# Altium project STM32F303VCT6_PLC.PrjPcb (part 1 of 2)
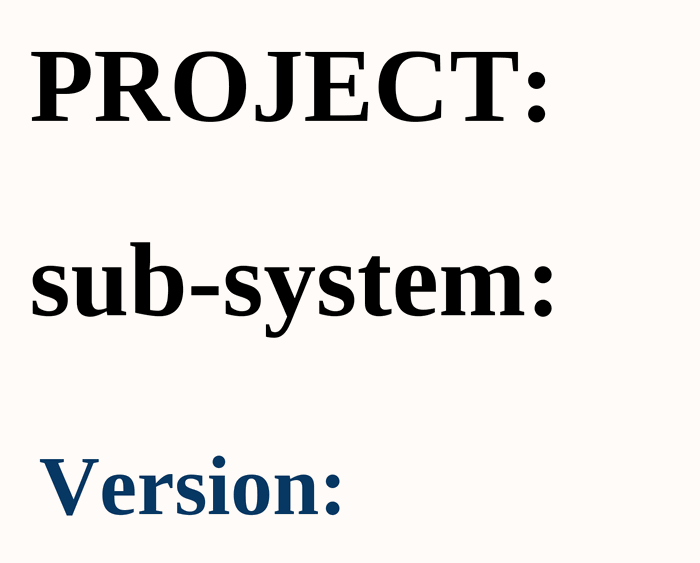
[diagram p0: 01_COVER PAGE.SchDoc]
MasterProject: STM32 PLC
12 sheets, 269 parts. Net scope: flat (ports and power ports of the same name join across sheets).
Board file: STM32F303VCT6_PLC.PcbDoc
Sheets:
  01_COVER PAGE.SchDoc
  02_BLOCK DIAGRAM.SchDoc
  03_INDEX.SchDoc
  04_STM32F303VCT6.SchDoc
  05_INPUT.SchDoc
  06_DIGITAL.SchDoc
  07_DADC.SchDoc
  08_INPUTCAPTURE_ENCODER.SchDoc
  09_CAN.SchDoc
  10_ADC.SchDoc
  11_DAC.SchDoc
  12_LED.SchDoc

## Sheet 01_COVER PAGE.SchDoc
size 420 x 297 mm; SheetNumber: 1; SheetTotal: 12

### Notes on the sheet
- PROJECT:
- sub-system:
- Version:
- Sub-system:
- Project:
- Design by:
- Sheet title:
- Sheet
- of
- Checked by:
- Approved by:
- Doc No:
- Revision:
- Size:
- Date:
- A3

## Sheet 02_BLOCK DIAGRAM.SchDoc
size 420 x 297 mm; SheetNumber: 2; SheetTotal: 12

### Notes on the sheet
- Sub-system:
- Project:
- Design by:
- Sheet title:
- Sheet
- of
- Checked by:
- Approved by:
- Doc No:
- Revision:
- Size:
- Date:
- A3

## Sheet 03_INDEX.SchDoc
size 420 x 297 mm; SheetNumber: 3; SheetTotal: 12

### Notes on the sheet
- Sub-system:
- Project:
- Design by:
- Sheet title:
- Sheet
- of
- Checked by:
- Approved by:
- Doc No:
- Revision:
- Size:
- Date:
- A3

## Sheet 04_STM32F303VCT6.SchDoc
size 420 x 297 mm; SheetNumber: 4; SheetTotal: 12
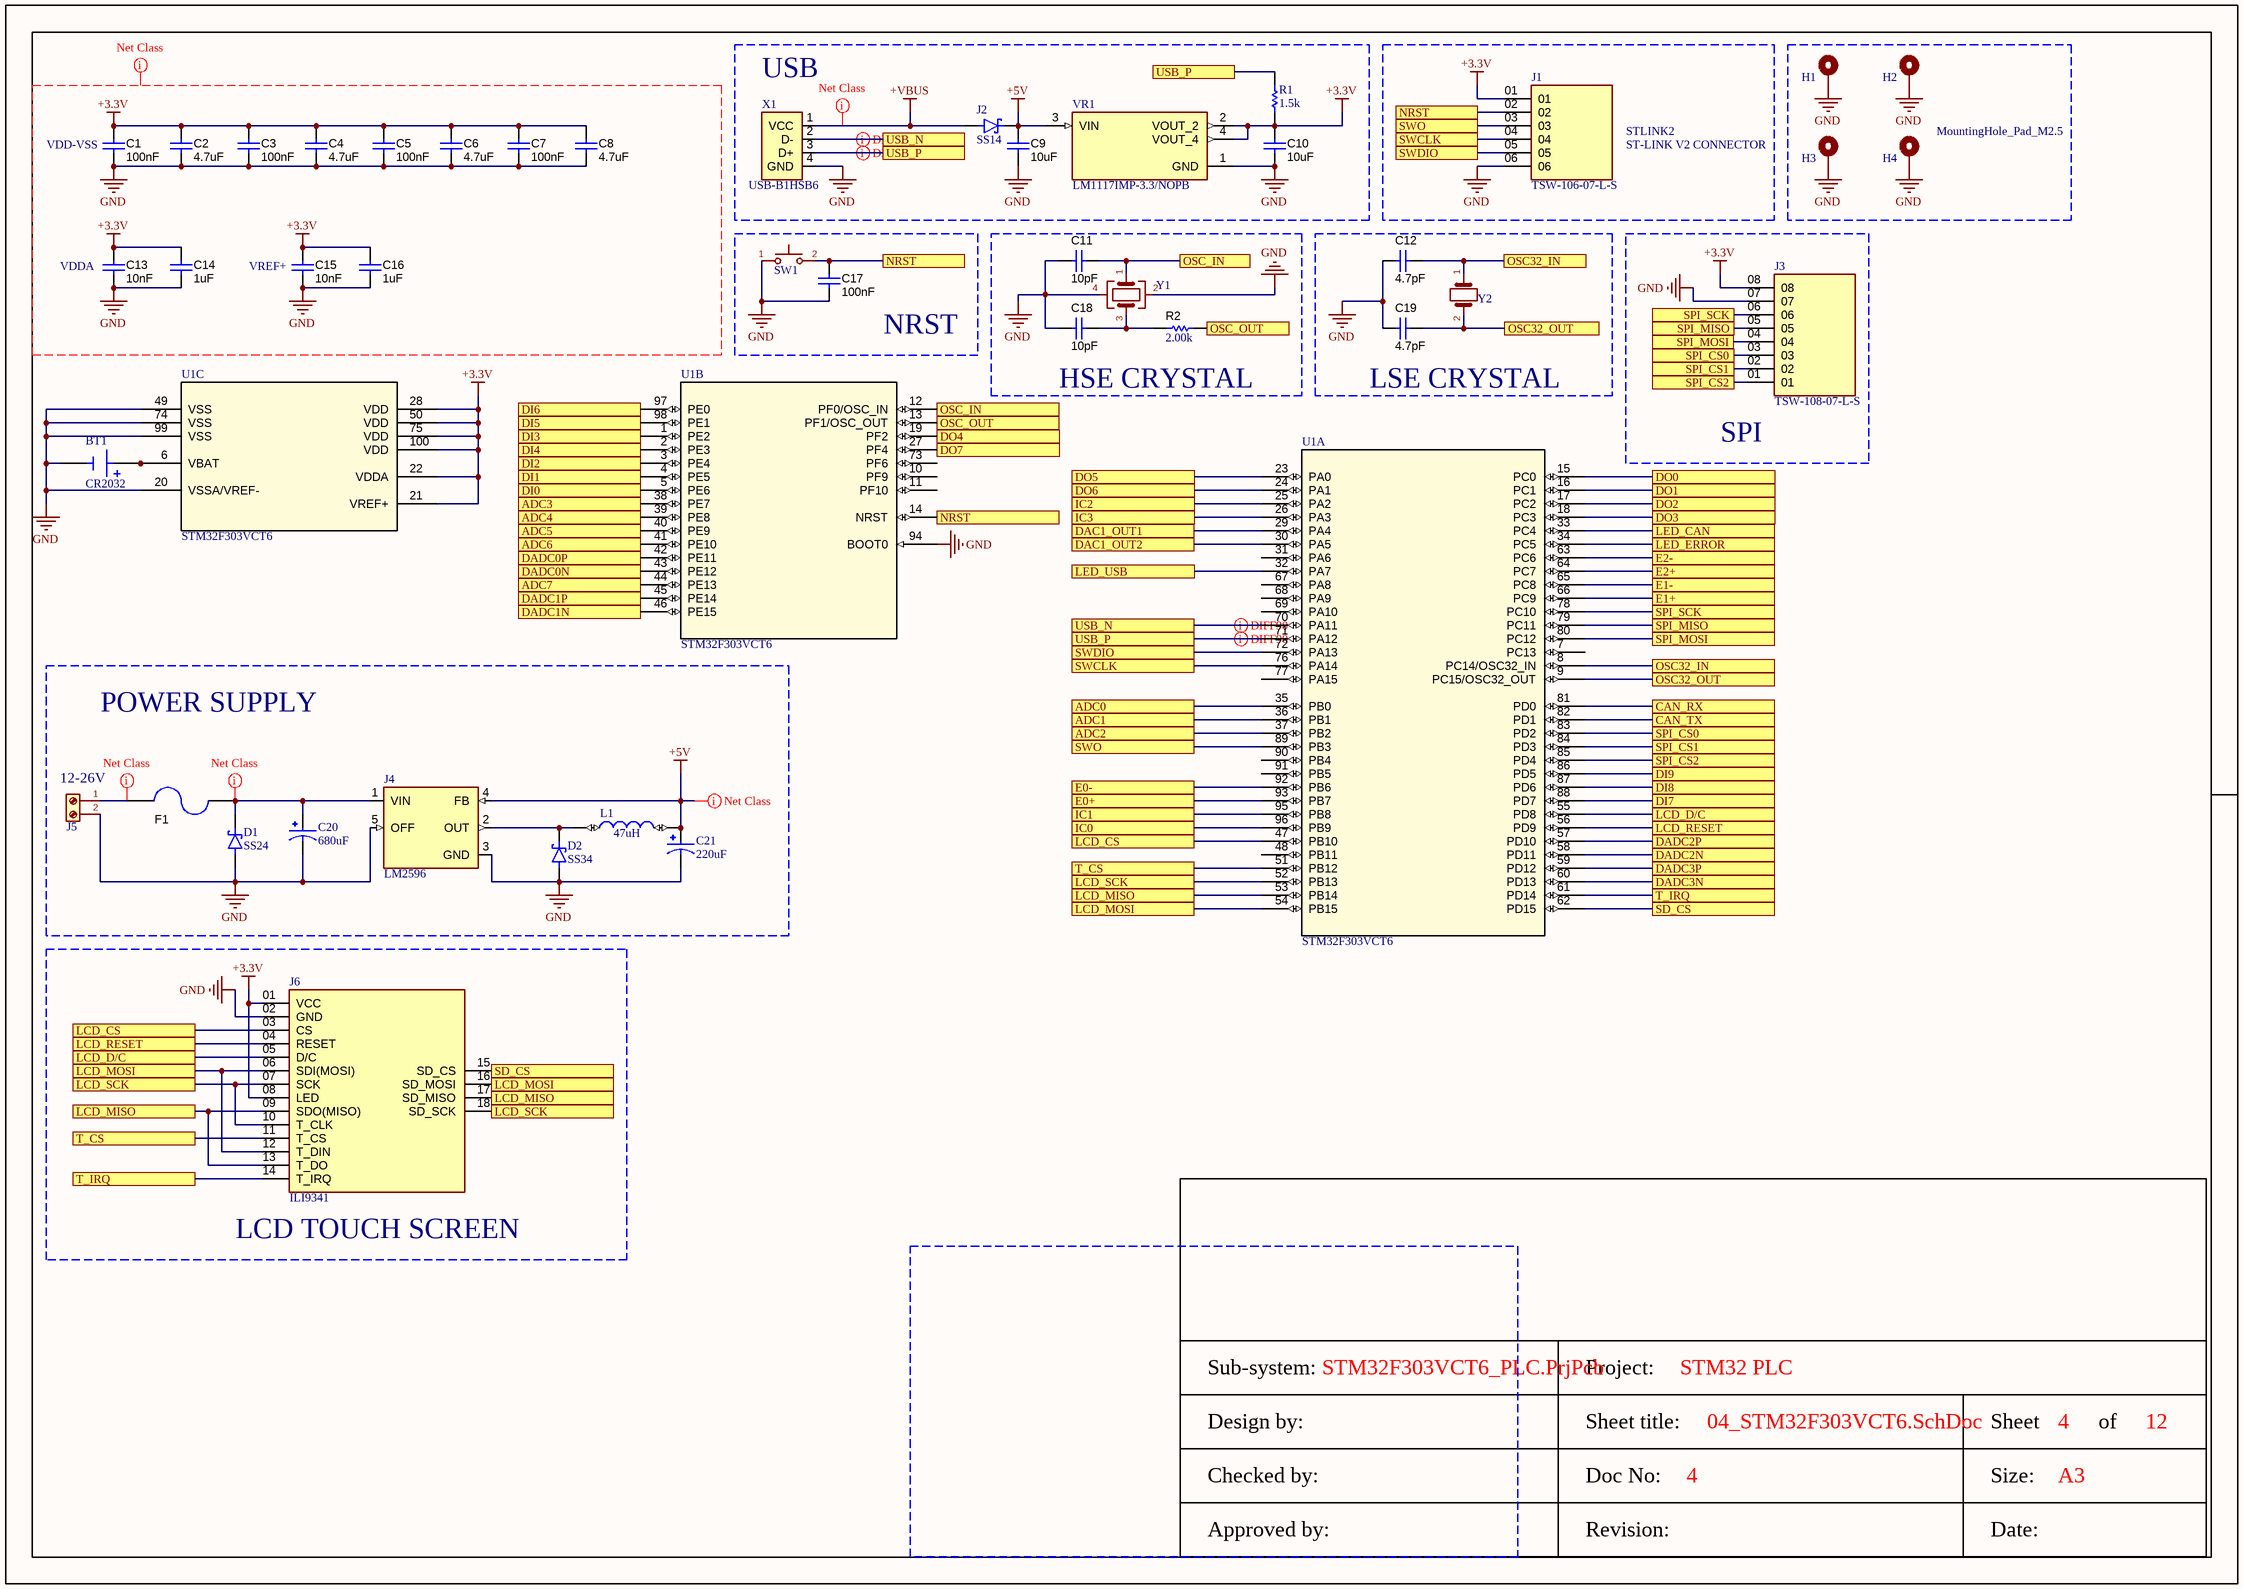
[diagram p1: 04_STM32F303VCT6.SchDoc]

### Parts
BT1  CR2032  [BAT_1074]
C1  ValueDisplayed: 100nF  [0603]  (hidden comment: CAP 100nF 0603)
C2  ValueDisplayed: 4.7uF  [0603]  (hidden comment: CAP 4.7uF 0603)
C3  ValueDisplayed: 100nF  [0603]  (hidden comment: CAP 100nF 0603)
C4  ValueDisplayed: 4.7uF  [0603]  (hidden comment: CAP 4.7uF 0603)
C5  ValueDisplayed: 100nF  [0603]  (hidden comment: CAP 100nF 0603)
C6  ValueDisplayed: 4.7uF  [0603]  (hidden comment: CAP 4.7uF 0603)
C7  ValueDisplayed: 100nF  [0603]  (hidden comment: CAP 100nF 0603)
C8  ValueDisplayed: 4.7uF  [0603]  (hidden comment: CAP 4.7uF 0603)
C9  ValueDisplayed: 10uF  [0603]  (hidden comment: GCM188R71C105KA64D)
C10  ValueDisplayed: 10uF  [0603]  (hidden comment: GCM188R71C105KA64D)
C11  ValueDisplayed: 10pF  [0402L]  (hidden comment: CGA2B3X7R1H104K050BB)
C12  ValueDisplayed: 4.7pF  [0402L]  (hidden comment: GJM1555C1H4R7BB01D)
C13  ValueDisplayed: 10nF  [0603]  (hidden comment: CAP 10nF 0603)
C14  ValueDisplayed: 1uF  [0603]  (hidden comment: GCM188R71C105KA64D)
C15  ValueDisplayed: 10nF  [0603]  (hidden comment: CAP 10nF 0603)
C16  ValueDisplayed: 1uF  [0603]  (hidden comment: GCM188R71C105KA64D)
C17  ValueDisplayed: 100nF  [0603]  (hidden comment: CAP 100nF 0603)
C18  ValueDisplayed: 10pF  [0402L]  (hidden comment: CGA2B3X7R1H104K050BB)
C19  ValueDisplayed: 4.7pF  [0402L]  (hidden comment: GJM1555C1H4R7BB01D)
C20  680uF  [CAP_EEETK1V331AQ]
C21  220uF  [CAP_EEEFT1E471AV]
D1  SS24  [DIOM5336X265N]
D2  SS34  [DIOM5336X265N]
F1  0440005.WR  [CAPC4520X203N]  (value not drawn)
H1  MountingHole_Pad M2.5  [MountingHole_2.7mm_M2.5_DIN965_Pad]  (value not drawn)
H2  MountingHole_Pad M2.5  [MountingHole_2.7mm_M2.5_DIN965_Pad]  (value not drawn)
H3  MountingHole_Pad M2.5  [MountingHole_2.7mm_M2.5_DIN965_Pad]  (value not drawn)
H4  MountingHole_Pad M2.5  [MountingHole_2.7mm_M2.5_DIN965_Pad]  (value not drawn)
J1  TSW-106-07-L-S  [SAMTEC_TSW-106-07-L-S]
J2  SS14  [SMA]
J3  TSW-108-07-L-S  [SAMTEC_TSW-108-07-L-S]
J4  LM2596  [TO263-5]
J5  Terminal_01x02_P5.00  [TerminalBlock_Phoenix_PT-1,5-2-5.0-H_1x02_P5.00mm_Horizontal]  (value not drawn)
J6  ILI9341  [ILI9341]
L1  47uH  [INDPM120120X800N]
R1  ValueDisplayed: 1.5k  [0603]  (hidden comment: RES 1.5K 0603)
R2  ValueDisplayed: 2.00k  [0402L]  (hidden comment: CRCW04021K00FKED)
SW1  SW_Push 3X6x2.5MM  [SW_SPST_FSMSM]  (value not drawn)
U1  STM32F303VCT6  [STM-LQFP100_N]  (parts A,B,C of 3)
VR1  LM1117IMP-3.3/NOPB  [VREG_LM1117IMP-3.3/NOPB]
X1  USB-B1HSB6  [OST_USB-B1HSB6]
Y1  Crystal 8MHz 3225  [Crystal_SMD_3225-4Pin_3.2x2.5mm_HandSoldering]  (value not drawn)
Y2  Crystal 32.768KHz 3215  [Crystal_SMD_EuroQuartz_EQ161-2Pin_3.2x1.5mm_HandSoldering]  (value not drawn)

### Blocks framed on the sheet
USB: C9 C10 J2 R1 VR1 X1
MountingHole_Pad_M2.5: H1-H4
NRST: C17 SW1
HSE CRYSTAL: C11 C18 R2 Y1
LSE CRYSTAL: C12 C19 Y2
SPI: J3
POWER SUPPLY: C20 C21 D1 D2 F1 J4 J5 L1
LCD TOUCH SCREEN: J6

### Ports
ADC0 (see 10_ADC[2A]), ADC1 (see 10_ADC[2A]), ADC2 (see 10_ADC[2B]), ADC3 (see 10_ADC[2B]), ADC4 (see 10_ADC[2B]), ADC5 (see 10_ADC[2C]), ADC6 (see 10_ADC[3A]), ADC7 (see 10_ADC[3A]), CAN_RX (see 09_CAN[1A]), CAN_TX (see 09_CAN[1A]), DAC1_OUT1 (see 11_DAC[1A]), DAC1_OUT2 (see 11_DAC[1B]), DADC0N (see 07_DADC[2A]), DADC0P (see 07_DADC[2A]), DADC1N (see 07_DADC[2B]), DADC1P (see 07_DADC[2B]), DADC2N (see 07_DADC[2C]), DADC2P (see 07_DADC[2B]), DADC3N (see 07_DADC[3A]), DADC3P (see 07_DADC[3A]), DI0 (see 05_INPUT[2A]), DI1 (see 05_INPUT[2B]), DI2 (see 05_INPUT[2B]), DI3 (see 05_INPUT[2C]), DI4 (see 05_INPUT[2C]), DI5 (see 05_INPUT[3A]), DI6 (see 05_INPUT[3B]), DI7 (see 05_INPUT[3B]), DI8 (see 05_INPUT[3C]), DI9 (see 05_INPUT[3C]), DO0 (see 06_DIGITAL[1A]), DO1 (see 06_DIGITAL[1B]), DO2 (see 06_DIGITAL[1B]), DO3 (see 06_DIGITAL[1C]), DO4 (see 06_DIGITAL[2A]), DO5 (see 06_DIGITAL[2B]), DO6 (see 06_DIGITAL[2B]), DO7 (see 06_DIGITAL[2C]), E0+ (see 08_INPUTCAPTURE_ENCODER[5B]), E0- (see 08_INPUTCAPTURE_ENCODER[5B]), E1+ (see 08_INPUTCAPTURE_ENCODER[5B]), E1- (see 08_INPUTCAPTURE_ENCODER[5B]), E2+ (see 08_INPUTCAPTURE_ENCODER[5B]), E2- (see 08_INPUTCAPTURE_ENCODER[5B]), IC0 (see 08_INPUTCAPTURE_ENCODER[3B]), IC1 (see 08_INPUTCAPTURE_ENCODER[3B]), IC2 (see 08_INPUTCAPTURE_ENCODER[3B]), IC3 (see 08_INPUTCAPTURE_ENCODER[3B]), LCD_CS (see 04_STM32F303VCT6[1C]), LCD_CS (see 04_STM32F303VCT6[3C]), LCD_D/C (see 04_STM32F303VCT6[1C]), LCD_D/C (see 04_STM32F303VCT6[5C]), LCD_MISO (see 04_STM32F303VCT6[1C], 04_STM32F303VCT6[2C]), LCD_MISO (see 04_STM32F303VCT6[1C], 04_STM32F303VCT6[3C]), LCD_MISO (see 04_STM32F303VCT6[2C], 04_STM32F303VCT6[3C]), LCD_MOSI (see 04_STM32F303VCT6[1C], 04_STM32F303VCT6[2C]), LCD_MOSI (see 04_STM32F303VCT6[1C], 04_STM32F303VCT6[3C]), LCD_MOSI (see 04_STM32F303VCT6[2C], 04_STM32F303VCT6[3C]), LCD_RESET (see 04_STM32F303VCT6[1C]), LCD_RESET (see 04_STM32F303VCT6[5C]), LCD_SCK (see 04_STM32F303VCT6[1C], 04_STM32F303VCT6[2C]), LCD_SCK (see 04_STM32F303VCT6[1C], 04_STM32F303VCT6[3C]), LCD_SCK (see 04_STM32F303VCT6[2C], 04_STM32F303VCT6[3C]), LED_CAN (see 12_LED[2B]), LED_ERROR (see 12_LED[2B]), LED_USB (see 12_LED[2A]), NRST (see 04_STM32F303VCT6[3A], 04_STM32F303VCT6[3B]), NRST (see 04_STM32F303VCT6[3A], 04_STM32F303VCT6[4A]), NRST (see 04_STM32F303VCT6[3B], 04_STM32F303VCT6[4A]), OSC32_IN (see 04_STM32F303VCT6[5A]), OSC32_IN (see 04_STM32F303VCT6[5B]), OSC32_OUT (see 04_STM32F303VCT6[5A]), OSC32_OUT (see 04_STM32F303VCT6[5B]), OSC_IN (see 04_STM32F303VCT6[3B]), OSC_IN (see 04_STM32F303VCT6[4A]), OSC_OUT (see 04_STM32F303VCT6[3B]), OSC_OUT (see 04_STM32F303VCT6[4A]), SD_CS (see 04_STM32F303VCT6[2C]), SD_CS (see 04_STM32F303VCT6[5C]), SPI_CS0 (see 04_STM32F303VCT6[5A]), SPI_CS0 (see 04_STM32F303VCT6[5B]), SPI_CS1 (see 04_STM32F303VCT6[5A]), SPI_CS1 (see 04_STM32F303VCT6[5B]), SPI_CS2 (see 04_STM32F303VCT6[5A]), SPI_CS2 (see 04_STM32F303VCT6[5B]), SPI_MISO (see 04_STM32F303VCT6[5A]), SPI_MISO (see 04_STM32F303VCT6[5B]), SPI_MOSI (see 04_STM32F303VCT6[5A]), SPI_MOSI (see 04_STM32F303VCT6[5B]), SPI_SCK (see 04_STM32F303VCT6[5A]), SPI_SCK (see 04_STM32F303VCT6[5B]), SWCLK (see 04_STM32F303VCT6[3B]), SWCLK (see 04_STM32F303VCT6[4A]), SWDIO (see 04_STM32F303VCT6[3B]), SWDIO (see 04_STM32F303VCT6[4A]), SWO (see 04_STM32F303VCT6[3B]), SWO (see 04_STM32F303VCT6[4A]), T_CS (see 04_STM32F303VCT6[1C]), T_CS (see 04_STM32F303VCT6[3C]), T_IRQ (see 04_STM32F303VCT6[1C]), T_IRQ (see 04_STM32F303VCT6[5C]), USB_N (see 04_STM32F303VCT6[3A]), USB_N (see 04_STM32F303VCT6[3B]), USB_P (see 04_STM32F303VCT6[3A], 04_STM32F303VCT6[3B]), USB_P (see 04_STM32F303VCT6[3A], 04_STM32F303VCT6[4A]), USB_P (see 04_STM32F303VCT6[3B], 04_STM32F303VCT6[4A])

### Nets
+3.3V: C1.1 C2.1 C3.1 C4.1 C5.1 C6.1 C7.1 C8.1 C10.1 C13.1 C14.1 C15.1 C16.1 J1.01 J3.08 J6.01(VCC) J6.08(LED) R1.1 U1.21(VREF+) U1.22(VDDA) U1.28(VDD) U1.50(VDD) U1.75(VDD) U1.100(VDD) VR1.2(VOUT_2) VR1.4(VOUT_4)
+5V: C9.1 C21.1 J2.P2(C) J4.4(FB) L1.2 VR1.3(VIN)
+VBUS: J2.P1(A) X1.1(VCC)
GND: BT1.N(NEG) C1.2 C2.2 C3.2 C4.2 C5.2 C6.2 C7.2 C8.2 C9.2 C10.2 C11.2 C12.2 C13.2 C14.2 C15.2 C16.2 C17.2 C18.2 C19.2 C20.2 C21.2 D1.A D2.A H1.1 H2.1 H3.1 H4.1 J1.06 J3.07 J4.3(GND) J4.5(OFF) J5.2(Pin_2) J6.02(GND) SW1.1 U1.20(VSSA/VREF-) U1.49(VSS) U1.74(VSS) U1.94(BOOT0) U1.99(VSS) VR1.1(GND) X1.4(GND) Y1.2 Y1.4
ADC0: U1.35(PB0) ; port ADC0
ADC1: U1.36(PB1) ; port ADC1
ADC2: U1.37(PB2) ; port ADC2
ADC3: U1.38(PE7) ; port ADC3
ADC4: U1.39(PE8) ; port ADC4
ADC5: U1.40(PE9) ; port ADC5
ADC6: U1.41(PE10) ; port ADC6
ADC7: U1.44(PE13) ; port ADC7
CAN_RX: U1.81(PD0) ; port CAN_RX
CAN_TX: U1.82(PD1) ; port CAN_TX
DAC1_OUT1: U1.29(PA4) ; port DAC1_OUT1
DAC1_OUT2: U1.30(PA5) ; port DAC1_OUT2
DADC0N: U1.43(PE12) ; port DADC0N
DADC0P: U1.42(PE11) ; port DADC0P
DADC1N: U1.46(PE15) ; port DADC1N
DADC1P: U1.45(PE14) ; port DADC1P
DADC2N: U1.58(PD11) ; port DADC2N
DADC2P: U1.57(PD10) ; port DADC2P
DADC3N: U1.60(PD13) ; port DADC3N
DADC3P: U1.59(PD12) ; port DADC3P
DI0: U1.5(PE6) ; port DI0
DI1: U1.4(PE5) ; port DI1
DI2: U1.3(PE4) ; port DI2
DI3: U1.1(PE2) ; port DI3
DI4: U1.2(PE3) ; port DI4
DI5: U1.98(PE1) ; port DI5
DI6: U1.97(PE0) ; port DI6
DI7: U1.88(PD7) ; port DI7
DI8: U1.87(PD6) ; port DI8
DI9: U1.86(PD5) ; port DI9
DO0: U1.15(PC0) ; port DO0
DO1: U1.16(PC1) ; port DO1
DO2: U1.17(PC2) ; port DO2
DO3: U1.18(PC3) ; port DO3
DO4: U1.19(PF2) ; port DO4
DO5: U1.23(PA0) ; port DO5
DO6: U1.24(PA1) ; port DO6
DO7: U1.27(PF4) ; port DO7
E0+: U1.93(PB7) ; port E0+
E0-: U1.92(PB6) ; port E0-
E1+: U1.66(PC9) ; port E1+
E1-: U1.65(PC8) ; port E1-
E2+: U1.64(PC7) ; port E2+
E2-: U1.63(PC6) ; port E2-
IC0: U1.96(PB9) ; port IC0
IC1: U1.95(PB8) ; port IC1
IC2: U1.25(PA2) ; port IC2
IC3: U1.26(PA3) ; port IC3
LCD_CS: J6.03(CS) U1.47(PB10) ; port LCD_CS
LCD_D/C: J6.05(D/C) U1.55(PD8) ; port LCD_D/C
LCD_MISO: J6.09(SDO(MISO)) J6.13(T_DO) J6.17(SD_MISO) U1.53(PB14) ; port LCD_MISO
LCD_MOSI: J6.06(SDI(MOSI)) J6.12(T_DIN) J6.16(SD_MOSI) U1.54(PB15) ; port LCD_MOSI
LCD_RESET: J6.04(RESET) U1.56(PD9) ; port LCD_RESET
LCD_SCK: J6.07(SCK) J6.10(T_CLK) J6.18(SD_SCK) U1.52(PB13) ; port LCD_SCK
LED_CAN: U1.33(PC4) ; port LED_CAN
LED_ERROR: U1.34(PC5) ; port LED_ERROR
LED_USB: U1.32(PA7) ; port LED_USB
NRST: C17.1 J1.02 SW1.2 U1.14(NRST) ; port NRST
OSC32_IN: C12.1 U1.8(PC14/OSC32_IN) Y2.1 ; port OSC32_IN
OSC32_OUT: C19.1 U1.9(PC15/OSC32_OUT) Y2.2 ; port OSC32_OUT
OSC_IN: C11.1 U1.12(PF0/OSC_IN) Y1.1 ; port OSC_IN
OSC_OUT: R2.2 U1.13(PF1/OSC_OUT) ; port OSC_OUT
SD_CS: J6.15(SD_CS) U1.62(PD15) ; port SD_CS
SPI_CS0: J3.03 U1.83(PD2) ; port SPI_CS0
SPI_CS1: J3.02 U1.84(PD3) ; port SPI_CS1
SPI_CS2: J3.01 U1.85(PD4) ; port SPI_CS2
SPI_MISO: J3.05 U1.79(PC11) ; port SPI_MISO
SPI_MOSI: J3.04 U1.80(PC12) ; port SPI_MOSI
SPI_SCK: J3.06 U1.78(PC10) ; port SPI_SCK
SWCLK: J1.04 U1.76(PA14) ; port SWCLK
SWDIO: J1.05 U1.72(PA13) ; port SWDIO
SWO: J1.03 U1.89(PB3) ; port SWO
T_CS: J6.11(T_CS) U1.51(PB12) ; port T_CS
T_IRQ: J6.14(T_IRQ) U1.61(PD14) ; port T_IRQ
USB_N: U1.70(PA11) X1.2(D-) ; port USB_N
USB_P: R1.2 U1.71(PA12) X1.3(D+) ; port USB_P
NetBT1_P_1: BT1.P_1(POS) BT1.P_2(POS) U1.6(VBAT)
NetC18_1: C18.1 R2.1 Y1.3
NetC20_1: C20.1 D1.C(K) F1.1 J4.1(VIN)
NetD2_C: D2.C(K) J4.2(OUT) L1.1
NetF1_2: F1.2 J5.1(Pin_1)

Not connected (* = marked no-connect by the designer): U1 7(PC13) 10(PF9) 11(PF10) 31(PA6) 48(PB11) 67(PA8) 68(PA9) 69(PA10) 73(PF6) 77(PA15) 90(PB4) 91(PB5)

### Layout directives
net class PWR: +3.3V, +5V, +VBUS, GND, NetC20_1, NetF1_2
differential pair; differential pair class DIFF90: USB_N, USB_P

### Notes on the sheet
- (near C1) VDD-VSS
- STLINK2
- ST-LINK V2 CONNECTOR
- (near C13) VDDA
- (near C15) VREF+
- (near J5) 12-26V
- Sub-system:
- Project:
- Design by:
- Sheet title:
- Sheet
- of
- Checked by:
- Approved by:
- Doc No:
- Revision:
- Size:
- Date:
- A3

### Library data of the parts
BT1 = CR2032: THM (Vertical) Holder for 20mm Cel; MF: Keystone Electronics; MP: 1074; SnapEDA_Link: https://www.snapeda.com/parts/1074/Keystone/view-part/?ref=snap; Package: None; Value: *; Check_prices: https://www.snapeda.com/parts/1074/Keystone/view-part/?ref=eda
C1 C3 C5 C7 C17 = CAP 100nF 0603: CAP, CERM, 100 nF, 25 V, +/- 10%, X7R, AEC-Q200 Grade 1, 0603; Manufacturer: MuRata; PartNumber: GCM188R70J225KE22D; TaMin_C: -55°C; Polarized: N; SizeAreaWB_mm2: 4.68; Value1: Unknown; U/M: EA; Value: 2.2uF; TaMax_C: 125°C; SizeZ_mm: 1; SizeX_mm: 1.6; SizeY_mm: 0.8; Value2: 6.3V; SizeArea_mm2: 1.28; CompType: Capacitor; AEC Qualified: Y; Cap_F: 2.2µF; AEC Category: Q200; Supplier Part Number 2: 81-GCM188R70J225KE2D; Publisher: Texas Instruments; Supplier 2: Mouser; TempCo: X7R; Published: 2008-06-19; RoHS: Y; MountType: SMT; Supplier 1: Digi-Key; PackageReference: 0603; Tolerance_%: 10%; Cap_Case: 0603; LatestRevisionDate: 2017-03-09; VDC_V: 6.3V; ComponentLink1Description: Datasheet link; AEC Grade: 1; Supplier Part Number 1: 490-5316-1-ND; Technology: Ceramic; ComponentLink1URL: http://psearch.en.murata.com/capacitor/product/GCM188R70J225KE22%23.pdf
C2 C4 C6 C8 = CAP 4.7uF 0603: CAP, CERM, 4.7 uF, 10 V, +/- 10%, X7R, AEC-Q200 Grade 1, 0603; Manufacturer: MuRata; PartNumber: GCM188R70J225KE22D; TaMin_C: -55°C; Polarized: N; SizeAreaWB_mm2: 4.68; Value1: Unknown; U/M: EA; Value: 2.2uF; TaMax_C: 125°C; SizeZ_mm: 1; SizeX_mm: 1.6; SizeY_mm: 0.8; Value2: 6.3V; SizeArea_mm2: 1.28; CompType: Capacitor; AEC Qualified: Y; Cap_F: 2.2µF; AEC Category: Q200; Supplier Part Number 2: 81-GCM188R70J225KE2D; Publisher: Texas Instruments; Supplier 2: Mouser; TempCo: X7R; Published: 2008-06-19; RoHS: Y; MountType: SMT; Supplier 1: Digi-Key; PackageReference: 0603; Tolerance_%: 10%; Cap_Case: 0603; LatestRevisionDate: 2017-03-09; VDC_V: 6.3V; ComponentLink1Description: Datasheet link; AEC Grade: 1; Supplier Part Number 1: 490-5316-1-ND; Technology: Ceramic; ComponentLink1URL: http://psearch.en.murata.com/capacitor/product/GCM188R70J225KE22%23.pdf
C9 C10 C14 C16 = CAP 1uF 0603: CAP, CERM, 1 uF, 16 V, +/- 10%, X7R, AEC-Q200 Grade 1, 0603; Manufacturer: MuRata; TaMin_C: -55°C; Polarized: N; SizeAreaWB_mm2: 4.68; Value1: Unknown; U/M: EA; Value: 1uF; TaMax_C: 125°C; SizeZ_mm: 1; SizeX_mm: 1.6; SizeY_mm: 0.8; Value2: 16V; SizeArea_mm2: 1.28; CompType: Capacitor; AEC Qualified: Y; Cap_F: 1µF; AEC Category: Q200; Supplier Part Number 2: 81-GCM188R71C105K64D; Publisher: Texas Instruments; Supplier 2: Mouser; TempCo: X7R; Published: 2008-06-19; RoHS: Y; MountType: SMT; Supplier 1: Digi-Key; PackageReference: 0603; Tolerance_%: 10%; Cap_Case: 0603; LatestRevisionDate: 2017-03-09; PartNumber: GCM188R71C105KA64D; VDC_V: 16V; ComponentLink1Description: Datasheet link; AEC Grade: 1; Supplier Part Number 1: 490-5241-6-ND; Technology: Ceramic; ComponentLink1URL: http://psearch.en.murata.com/capacitor/product/GCM188R71C105KA64%23.pdf
C11 C18 = CAP 10pF 0402 50V: CAP, CERM, 10 pF, 50 V, +/- 5%, X7R, AEC-Q200 Grade 1, 0402; Manufacturer: TDK; TaMin_C: -55°C; ESR_ohm: 0.039064; Polarized: N; SizeAreaWB_mm2: 3; Value1: 0.039064 ohm; U/M: EA; Value: 0.1uF; TaMax_C: 125°C; Tolerance_%: 10%; SizeZ_mm: 0.6; SizeX_mm: 1; SizeY_mm: 0.5; Cap_Case: 0402; Value2: 50V; CompType: Capacitor; AEC Qualified: Y; Cap_F: 100nF; IRMS_A: 8.14669dA; AEC Category: Q200; Supplier Part Number 2: 04X3148; Publisher: Texas Instruments; Supplier 2: Newark; Supplier Part Number 3: 810-CGA2B3X7R1H104K; TempCo: X7R; Supplier 3: Mouser; Published: 2008-06-19; RoHS: Y; MountType: SMT; Supplier 1: Digi-Key; PackageReference: 0402; SizeArea_mm2: 0.5; LatestRevisionDate: 2017-03-09; PartNumber: CGA2B3X7R1H104K050BB; VDC_V: 50V; ComponentLink1Description: Datasheet link; AEC Grade: 1; Supplier Part Number 1: 445-6899-1-ND; Technology: Ceramic; ComponentLink1URL: https://product.tdk.com/en/search/capacitor/ceramic/mlcc/info?part_no=CGA2B3X7R1H104K050BB
C12 C19 = CAP 4.7pF 0402: CAP, CERM, 4.7 pF, 50 V, +/- 2%, C0G/NP0, 0402; Manufacturer: MuRata; TaMin_C: -55°C; Polarized: N; SizeAreaWB_mm2: 3; Value1: Unknown; U/M: EA; Value: 4.7pF; TaMax_C: 125°C; SizeZ_mm: 0.6; SizeX_mm: 1; SizeY_mm: 0.5; Cap_Case: 0402; Value2: 50V; CompType: Capacitor; AEC Category: Q200; Supplier Part Number 2: 81-GJM1555C1H4R7BB01; Publisher: Texas Instruments; Supplier 2: Mouser; TempCo: C0G/NP0; Published: 2008-06-19; RoHS: Y; MountType: SMT; Supplier 1: Digi-Key; PackageReference: 0402; Tolerance_%: 2%; SizeArea_mm2: 0.5; LatestRevisionDate: 2017-03-09; PartNumber: GJM1555C1H4R7BB01D; AEC Qualified: N; Cap_F: 4.7pF; VDC_V: 50V; ComponentLink1Description: Datasheet link; AEC Grade: N/A; Supplier Part Number 1: 490-8102-1-ND; Technology: Ceramic; ComponentLink1URL: http://psearch.murata.com/capacitor/product/GJM1555C1H4R7BB01%23.pdf
C13 C15 = CAP 10nF 0603: CAP, CERM, 10 nF, 50 V, +/- 10%, X7R, AEC-Q200 Grade 1, 0603; Manufacturer: MuRata; PartNumber: GCM188R70J225KE22D; TaMin_C: -55°C; Polarized: N; SizeAreaWB_mm2: 4.68; Value1: Unknown; U/M: EA; Value: 2.2uF; TaMax_C: 125°C; SizeZ_mm: 1; SizeX_mm: 1.6; SizeY_mm: 0.8; Value2: 6.3V; SizeArea_mm2: 1.28; CompType: Capacitor; AEC Qualified: Y; Cap_F: 2.2µF; AEC Category: Q200; Supplier Part Number 2: 81-GCM188R70J225KE2D; Publisher: Texas Instruments; Supplier 2: Mouser; TempCo: X7R; Published: 2008-06-19; RoHS: Y; MountType: SMT; Supplier 1: Digi-Key; PackageReference: 0603; Tolerance_%: 10%; Cap_Case: 0603; LatestRevisionDate: 2017-03-09; VDC_V: 6.3V; ComponentLink1Description: Datasheet link; AEC Grade: 1; Supplier Part Number 1: 490-5316-1-ND; Technology: Ceramic; ComponentLink1URL: http://psearch.en.murata.com/capacitor/product/GCM188R70J225KE22%23.pdf
C20 = CAP ALUMINUM: CAPACITOR ALUM ELEC, 330UF, 20%, 35V, SMD; Product Range:PANASONIC - TK Series; Capacitance:330ÂµF; Capacitance Tolerance:Â± 20%; Capacitor Case Style:SMD; Diameter:12.5mm; ESR:0.12ohm; Height:13.5mm; Operating Temperature Max:125Â°C ;RoHS Compliant: Yes; MP: EEETK1V331AQ; Value: *; Price: None; Package: RADIAL-2 Panasonic; MF: Panasonic; Availability: No availability data; Check_prices: https://www.snapeda.com/parts/EEETK1V331AQ/Panasonic/view-part/5787067/?ref=eda; SnapEDA_Link: https://www.snapeda.com/parts/EEETK1V331AQ/Panasonic/view-part/5787067/?ref=snap
C21 = CAP ALUMINUM 8X10.5MM: Aluminum Electrolytic Capacitors, FT-V (????????) Series, 470uF +/- 20%, 25V, Surface mount type(8x10.5mm) Vibration-proof product; MF: Panasonic; MP: EEE-FT1E471AV; SnapEDA_Link: https://www.snapeda.com/parts/EEE-FT1E471AV/Panasonic/view-part/?ref=snap; Package: RADIAL-2 Panasonic; Value: *; Check_prices: https://www.snapeda.com/parts/EEE-FT1E471AV/Panasonic/view-part/?ref=eda
D1 D2 = SS24: Diode Schottky 40V 2A Surface Mount DO-214AA (SMB); MF: ON Semiconductor; Package: DO-214AA ON Semiconductor; Price: None; Value: *; SnapEDA_Link: https://www.snapeda.com/parts/SS24/Onsemi/view-part/?ref=snap; MP: SS24; Availability: In Stock; Check_prices: https://www.snapeda.com/parts/SS24/Onsemi/view-part/?ref=eda
F1 = FUSE 1808: Fuse, 5 A, 32VAC/VDC, SMD; Manufacturer: Littelfuse; Irating_A: 5A; SizeAreaWB_mm2: 10.92; Interrupt_AC: 50A; VAC_V: 32V; SizeZ_mm: 1.35; SizeX_mm: 3.2; SizeY_mm: 1.6; SizeArea_mm2: 5.12; Rtyp_Ohm: 0.012; MeltingTyp: 4.761; ComponentLink1URL: http://www.littelfuse.com/~/media/electronics/datasheets/fuses/littelfuse_fuse_440_datasheet.pdf.pdf; Supplier Part Number 2: 64R8013; Supplier 2: Newark; Supplier Part Number 3: 576-0440005.WR; Supplier 3: Mouser; RoHS: Y; MountType: SMT; Interrupt_DC: 50A; Supplier 1: Digi-Key; PackageReference: 1206; CompType: Fuse; PartNumber: 0440005.WR; VDC_V: 32V; ComponentLink1Description: Datasheet URL; Supplier Part Number 1: F1608CT-ND
J1 = TSW-106-07-L-S: MF: Samtec Inc.; Package: None; MP: TSW-106-07-L-S; Price: None; Value: *; Availability: Unavailable
J2 = SS14: Diode Schottky 40 V 1A Surface Mount DO-214AC (SMA); MF: ON; SnapEDA_Link: https://www.snapeda.com/parts/SS14/Onsemi/view-part/?ref=snap; Package: SMA-2 ON Semiconductor; Value: *; MP: SS14; Check_prices: https://www.snapeda.com/parts/SS14/Onsemi/view-part/?ref=eda
J3 = TSW-108-07-L-S: MF: Samtec Inc.; Availability: Unavailable; Price: None; Package: None; Value: *; MP: TSW-108-07-L-S
J4 = LM2596: MF: Texas Instruments; SnapEDA_Link: https://www.snapeda.com/parts/LM2596/Texas+Instruments/view-part/?ref=snap; Package: Package; Value: *; MP: LM2596; Check_prices: https://www.snapeda.com/parts/LM2596/Texas+Instruments/view-part/?ref=eda
J6 = ILI9341: LCD 2.4inch 240x320; MF: Samtec Inc.; MP: TSW-108-07-L-S; Availability: Unavailable; Price: None; Package: None; Value: *
L1 = CDRH127_LDNP-221MC: 220 ÂµH Shielded - Inductor 1.45 A 338mOhm Max Nonstandard; MF: Sumida America; MP: CDRH127/LDNP-221MC; SnapEDA_Link: https://www.snapeda.com/parts/CDRH127/LDNP-221MC/Sumida+America+Components+Inc./view-part/?ref=snap; Package: Nonstandard Sumida; Value: *; Check_prices: https://www.snapeda.com/parts/CDRH127/LDNP-221MC/Sumida+America+Components+Inc./view-part/?ref=eda
R1 = RES 1.5K 0603 1%: RES, 1.5K, 1%, 0.1 W, AEC-Q200 Grade 0, 0603; Manufacturer: Vishay-Dale; PartNumber: CRCW060320R0JNEA; Power_W: 100mW; TempCo: 200 ppm/C; Value_Code: 20R0; Value1: 5%; Value: 20; EIA_Code: E24; SizeX_mm: 1.6; SizeY_mm: 0.8; SizeZ_mm: 1; Value2: 0.1W; SizeArea_mm2: 1.28; CompType: Resistor; AEC Qualified: Y; VDC_V: 75V; AEC Category: Q200; AEC Grade: 0; Supplier Part Number 2: 59M6784; Supplier 2: Newark; Supplier Part Number 3: 71-CRCW0603J-20-E3; Supplier 3: Mouser; RoHS: E; MountType: SMT; Supplier 1: Digi-Key; PackageReference: 0603; Tolerance_%: 5%; Res_ohm: 20; ComponentLink1Description: Datasheet link; Supplier Part Number 1: 541-20GCT-ND; Technology: Thick Film; ComponentLink1URL: http://www.vishay.com/docs/20035/dcrcwe3.pdf
R2 = RES 2K 0402: RES, 2.00 k, 5%, 0.063 W, AEC-Q200 Grade 0, 0402; Manufacturer: Vishay-Dale; Power_W: 63mW; TempCo: 100 ppm/C; Value_Code: 1k00; Value1: 1%; Value: 1.00k; EIA_Code: E96; Res_ohm: 1k; SizeX_mm: 1; SizeY_mm: 0.5; SizeZ_mm: 0.6; Value2: 0.063W; CompType: Resistor; AEC Qualified: Y; VDC_V: 50V; AEC Category: Q200; AEC Grade: 0; Supplier Part Number 2: 52K6545; Supplier 2: Newark; Supplier Part Number 3: 71-CRCW0402-1.0K-E3; Supplier 3: Mouser; RoHS: E; MountType: SMT; Supplier 1: Digi-Key; PackageReference: 0402; Tolerance_%: 1%; SizeArea_mm2: 0.5; PartNumber: CRCW04021K00FKED; ComponentLink1Description: Datasheet link; Supplier Part Number 1: 541-1.00KLCT-ND; Technology: Thick Film; ComponentLink1URL: http://www.vishay.com/docs/20035/dcrcwe3.pdf
U1 = STM32F303VCT6: Mainstream Mixed signals MCUs Arm Cortex-M4 core with DSP and FPU, 256 Kbytes of Flash memory, 72 MHz CPU, MPU, CCM, 12-bit ADC 5 MSPS, PGA, comparators; Manufacturer_Name: STMicroelectronics; Copyright: Copyright (C) 2025 Ultra Librarian. All rights reserved.; Manufacturer_Part_Number: STM32F303VCT6; RefDes: RefDes; Type: Type
VR1 = LM1117IMP-3.3/NOPB: 800-mA 15-V linear voltage regulator; MF: Texas Instruments; SnapEDA_Link: https://www.snapeda.com/parts/LM1117IMP-3.3/NOPB/Texas+Instruments/view-part/?ref=snap; Package: SOT-223-4 Texas Instruments; Value: *; MP: LM1117IMP-3.3/NOPB; Check_prices: https://www.snapeda.com/parts/LM1117IMP-3.3/NOPB/Texas+Instruments/view-part/?ref=eda
X1 = USB-B1HSB6: USB-B (USB TYPE-B) - Receptacle Connector 4 Position Through Hole, Right Angle; MF: On Shore; Check_prices: https://www.snapeda.com/parts/USB-B1HSB6/On+Shore+Technology+Inc./view-part/?ref=eda; Value: *; Purchase-URL: https://pricing.snapeda.com/search/part/USB-B1HSB6/?ref=eda; Price: None; MP: USB-B1HSB6; SnapEDA_Link: https://www.snapeda.com/parts/USB-B1HSB6/On+Shore+Technology+Inc./view-part/?ref=snap; Availability: In Stock; Package: None

## Sheet 05_INPUT.SchDoc
size 420 x 297 mm; SheetNumber: 5; SheetTotal: 12
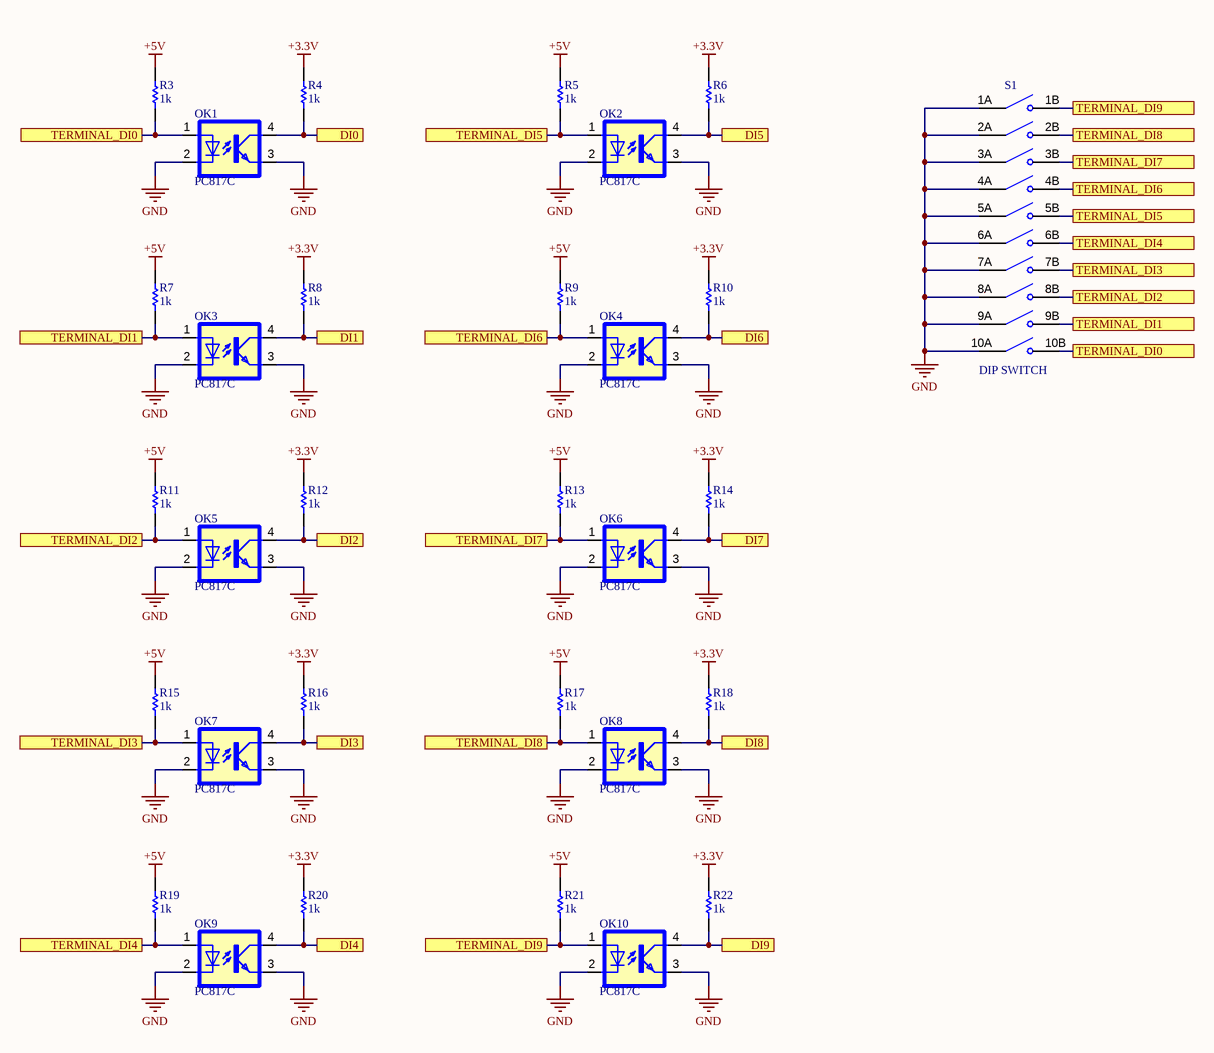
[diagram p2: 05_INPUT.SchDoc]

### Parts
OK1  PC817C  [SOP254P975X460-4N]
OK2  PC817C  [SOP254P975X460-4N]
OK3  PC817C  [SOP254P975X460-4N]
OK4  PC817C  [SOP254P975X460-4N]
OK5  PC817C  [SOP254P975X460-4N]
OK6  PC817C  [SOP254P975X460-4N]
OK7  PC817C  [SOP254P975X460-4N]
OK8  PC817C  [SOP254P975X460-4N]
OK9  PC817C  [SOP254P975X460-4N]
OK10  PC817C  [SOP254P975X460-4N]
R3  ValueDisplayed: 1k  [0603]  (hidden comment: RES 1.5K 0603)
R4  ValueDisplayed: 1k  [0603]  (hidden comment: RES 1.5K 0603)
R5  ValueDisplayed: 1k  [0603]  (hidden comment: RES 1.5K 0603)
R6  ValueDisplayed: 1k  [0603]  (hidden comment: RES 1.5K 0603)
R7  ValueDisplayed: 1k  [0603]  (hidden comment: RES 1.5K 0603)
R8  ValueDisplayed: 1k  [0603]  (hidden comment: RES 1.5K 0603)
R9  ValueDisplayed: 1k  [0603]  (hidden comment: RES 1.5K 0603)
R10  ValueDisplayed: 1k  [0603]  (hidden comment: RES 1.5K 0603)
R11  ValueDisplayed: 1k  [0603]  (hidden comment: RES 1.5K 0603)
R12  ValueDisplayed: 1k  [0603]  (hidden comment: RES 1.5K 0603)
R13  ValueDisplayed: 1k  [0603]  (hidden comment: RES 1.5K 0603)
R14  ValueDisplayed: 1k  [0603]  (hidden comment: RES 1.5K 0603)
R15  ValueDisplayed: 1k  [0603]  (hidden comment: RES 1.5K 0603)
R16  ValueDisplayed: 1k  [0603]  (hidden comment: RES 1.5K 0603)
R17  ValueDisplayed: 1k  [0603]  (hidden comment: RES 1.5K 0603)
R18  ValueDisplayed: 1k  [0603]  (hidden comment: RES 1.5K 0603)
R19  ValueDisplayed: 1k  [0603]  (hidden comment: RES 1.5K 0603)
R20  ValueDisplayed: 1k  [0603]  (hidden comment: RES 1.5K 0603)
R21  ValueDisplayed: 1k  [0603]  (hidden comment: RES 1.5K 0603)
R22  ValueDisplayed: 1k  [0603]  (hidden comment: RES 1.5K 0603)
S1  DIP SWITCH  [SW_DS01-254-L-10BE]

### Ports
DI0 (see 04_STM32F373VBTx[5C]), DI1 (see 04_STM32F373VBTx[5C]), DI2 (see 04_STM32F373VBTx[5C]), DI3 (see 04_STM32F373VBTx[5C]), DI4 (see 04_STM32F373VBTx[5C]), DI5 (see 04_STM32F373VBTx[5C]), DI6 (see 04_STM32F373VBTx[6B]), DI7 (see 04_STM32F373VBTx[6B]), DI8 (see 04_STM32F373VBTx[6C]), DI9 (see 04_STM32F373VBTx[6C]), TERMINAL_DI0 (see 05_INPUT[1A]), TERMINAL_DI0 (see 05_INPUT[4B]), TERMINAL_DI1 (see 05_INPUT[1B]), TERMINAL_DI1 (see 05_INPUT[4B]), TERMINAL_DI2 (see 05_INPUT[1B]), TERMINAL_DI2 (see 05_INPUT[4A]), TERMINAL_DI3 (see 05_INPUT[1C]), TERMINAL_DI3 (see 05_INPUT[4A]), TERMINAL_DI4 (see 05_INPUT[1C]), TERMINAL_DI4 (see 05_INPUT[4A]), TERMINAL_DI5 (see 05_INPUT[2A]), TERMINAL_DI5 (see 05_INPUT[4A]), TERMINAL_DI6 (see 05_INPUT[2B]), TERMINAL_DI6 (see 05_INPUT[4A]), TERMINAL_DI7 (see 05_INPUT[2B]), TERMINAL_DI7 (see 05_INPUT[4A]), TERMINAL_DI8 (see 05_INPUT[2C]), TERMINAL_DI8 (see 05_INPUT[4A]), TERMINAL_DI9 (see 05_INPUT[2C]), TERMINAL_DI9 (see 05_INPUT[4A])

### Nets
+3.3V: R4.2 R6.2 R8.2 R10.2 R12.2 R14.2 R16.2 R18.2 R20.2 R22.2
+5V: R3.2 R5.2 R7.2 R9.2 R11.2 R13.2 R15.2 R17.2 R19.2 R21.2
GND: OK1.2(C) OK1.3(EMIT) OK2.2(C) OK2.3(EMIT) OK3.2(C) OK3.3(EMIT) OK4.2(C) OK4.3(EMIT) OK5.2(C) OK5.3(EMIT) OK6.2(C) OK6.3(EMIT) OK7.2(C) OK7.3(EMIT) OK8.2(C) OK8.3(EMIT) OK9.2(C) OK9.3(EMIT) OK10.2(C) OK10.3(EMIT) S1.1A(COM1) S1.2A(COM2) S1.3A(COM3) S1.4A(COM4) S1.5A(COM5) S1.6A(COM6) S1.7A(COM7) S1.8A(COM8) S1.9A(COM9) S1.10A(COM10)
DI0: OK1.4(COL) R4.1 ; port DI0
DI1: OK3.4(COL) R8.1 ; port DI1
DI2: OK5.4(COL) R12.1 ; port DI2
DI3: OK7.4(COL) R16.1 ; port DI3
DI4: OK9.4(COL) R20.1 ; port DI4
DI5: OK2.4(COL) R6.1 ; port DI5
DI6: OK4.4(COL) R10.1 ; port DI6
DI7: OK6.4(COL) R14.1 ; port DI7
DI8: OK8.4(COL) R18.1 ; port DI8
DI9: OK10.4(COL) R22.1 ; port DI9
TERMINAL_DI0: OK1.1(A) R3.1 S1.10B(NO10) ; port TERMINAL_DI0
TERMINAL_DI1: OK3.1(A) R7.1 S1.9B(NO9) ; port TERMINAL_DI1
TERMINAL_DI2: OK5.1(A) R11.1 S1.8B(NO8) ; port TERMINAL_DI2
TERMINAL_DI3: OK7.1(A) R15.1 S1.7B(NO7) ; port TERMINAL_DI3
TERMINAL_DI4: OK9.1(A) R19.1 S1.6B(NO6) ; port TERMINAL_DI4
TERMINAL_DI5: OK2.1(A) R5.1 S1.5B(NO5) ; port TERMINAL_DI5
TERMINAL_DI6: OK4.1(A) R9.1 S1.4B(NO4) ; port TERMINAL_DI6
TERMINAL_DI7: OK6.1(A) R13.1 S1.3B(NO3) ; port TERMINAL_DI7
TERMINAL_DI8: OK8.1(A) R17.1 S1.2B(NO2) ; port TERMINAL_DI8
TERMINAL_DI9: OK10.1(A) R21.1 S1.1B(NO1) ; port TERMINAL_DI9

### Notes on the sheet
- Sub-system:
- Project:
- Design by:
- Sheet title:
- Sheet
- of
- Checked by:
- Approved by:
- Doc No:
- Revision:
- Size:
- Date:
- A3

### Library data of the parts
OK1-OK10 = PC817C: RF Mixer IC Cellular, DCS, PCS, W-CDMA, WLAN Up Converter 50MHz ~ 400MHz 6-SuperMiniMold; MF: Renesas Electronics America Inc; MP: PC817; SnapEDA_Link: https://www.snapeda.com/parts/PC817/Renesas/view-part/?ref=snap; Package: None; Value: *; Check_prices: https://www.snapeda.com/parts/PC817/Renesas/view-part/?ref=eda
R3-R22 = RES 1.5K 0603 1%: as R1 on sheet 04_STM32F303VCT6; Supplier Part Number 2: 59M6784; Supplier 2: Newark; Supplier Part Number 3: 71-CRCW0603J-20-E3; Supplier 3: Mouser; RoHS: E; MountType: SMT; Supplier 1: Digi-Key; PackageReference: 0603; Tolerance_%: 5%; Res_ohm: 20; ComponentLink1Description: Datasheet link; Supplier Part Number 1: 541-20GCT-ND; Technology: Thick Film; ComponentLink1URL: http://www.vishay.com/docs/20035/dcrcwe3.pdf
S1 = DS01-254-L-10BE: 10 Position, Through Hole, 2.54 mm Pitch, Raised Slide Actuator, Flat Bottom, Long Pin, DIP Switch; MF: Same Sky; SnapEDA_Link: https://www.snapeda.com/parts/DS01-254-L-10BE/Same+Sky/view-part/?ref=snap; Package: None; Value: *; MP: DS01-254-L-10BE; Check_prices: https://www.snapeda.com/parts/DS01-254-L-10BE/Same+Sky/view-part/?ref=eda

## Sheet 06_DIGITAL.SchDoc
size 420 x 297 mm; SheetNumber: 6; SheetTotal: 12
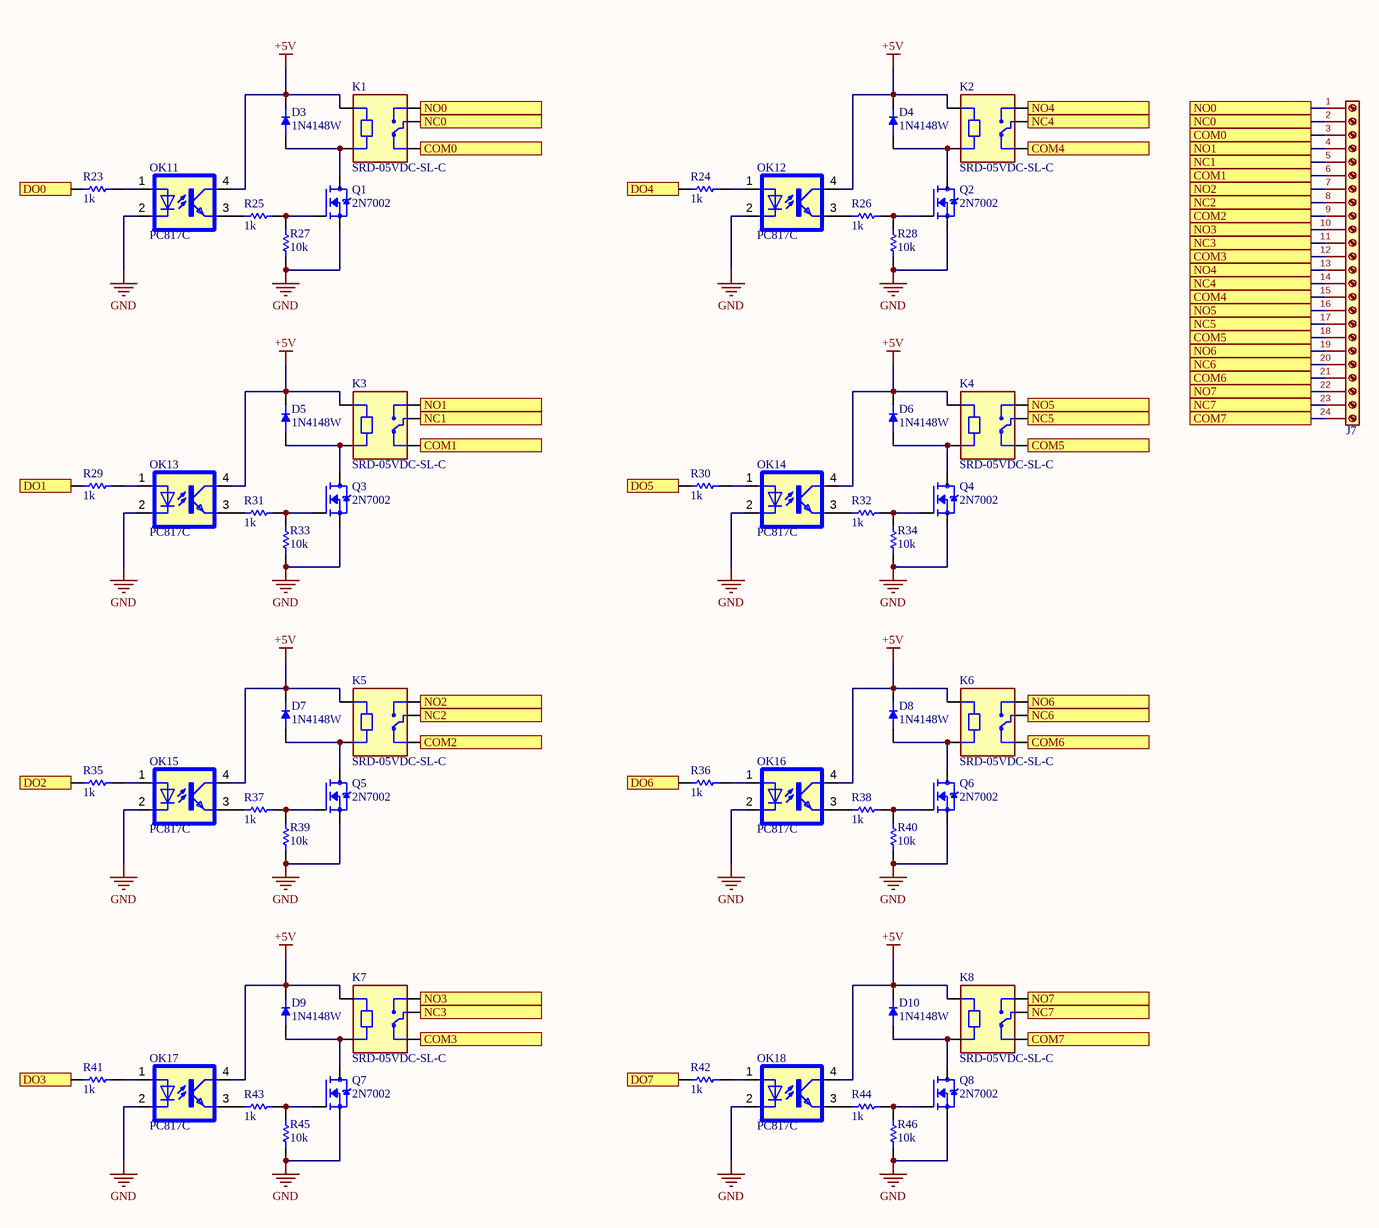
[diagram p3: 06_DIGITAL.SchDoc]

### Parts
D3  1N4148W  [SOD3715X135N]
D4  1N4148W  [SOD3715X135N]
D5  1N4148W  [SOD3715X135N]
D6  1N4148W  [SOD3715X135N]
D7  1N4148W  [SOD3715X135N]
D8  1N4148W  [SOD3715X135N]
D9  1N4148W  [SOD3715X135N]
D10  1N4148W  [SOD3715X135N]
J7  Terminal_01x24_P5.00  [TerminalBlock_Phoenix_PT-1,5-24-5.0-H_1x24_P5.00mm_Horizontal]  (value not drawn)
K1  SRD-05VDC-SL-C  [RELAY_SRD-05VDC-SL-C]
K2  SRD-05VDC-SL-C  [RELAY_SRD-05VDC-SL-C]
K3  SRD-05VDC-SL-C  [RELAY_SRD-05VDC-SL-C]
K4  SRD-05VDC-SL-C  [RELAY_SRD-05VDC-SL-C]
K5  SRD-05VDC-SL-C  [RELAY_SRD-05VDC-SL-C]
K6  SRD-05VDC-SL-C  [RELAY_SRD-05VDC-SL-C]
K7  SRD-05VDC-SL-C  [RELAY_SRD-05VDC-SL-C]
K8  SRD-05VDC-SL-C  [RELAY_SRD-05VDC-SL-C]
OK11  PC817C  [SOP254P975X460-4N]
OK12  PC817C  [SOP254P975X460-4N]
OK13  PC817C  [SOP254P975X460-4N]
OK14  PC817C  [SOP254P975X460-4N]
OK15  PC817C  [SOP254P975X460-4N]
OK16  PC817C  [SOP254P975X460-4N]
OK17  PC817C  [SOP254P975X460-4N]
OK18  PC817C  [SOP254P975X460-4N]
Q1  2N7002  [SOT95P240X111-3N]
Q2  2N7002  [SOT95P240X111-3N]
Q3  2N7002  [SOT95P240X111-3N]
Q4  2N7002  [SOT95P240X111-3N]
Q5  2N7002  [SOT95P240X111-3N]
Q6  2N7002  [SOT95P240X111-3N]
Q7  2N7002  [SOT95P240X111-3N]
Q8  2N7002  [SOT95P240X111-3N]
R23  ValueDisplayed: 1k  [0603]  (hidden comment: RES 10K 0603)
R24  ValueDisplayed: 1k  [0603]  (hidden comment: RES 10K 0603)
R25  ValueDisplayed: 1k  [0603]  (hidden comment: RES 10K 0603)
R26  ValueDisplayed: 1k  [0603]  (hidden comment: RES 10K 0603)
R27  ValueDisplayed: 10k  [0603]  (hidden comment: RES 10K 0603)
R28  ValueDisplayed: 10k  [0603]  (hidden comment: RES 10K 0603)
R29  ValueDisplayed: 1k  [0603]  (hidden comment: RES 10K 0603)
R30  ValueDisplayed: 1k  [0603]  (hidden comment: RES 10K 0603)
R31  ValueDisplayed: 1k  [0603]  (hidden comment: RES 10K 0603)
R32  ValueDisplayed: 1k  [0603]  (hidden comment: RES 10K 0603)
R33  ValueDisplayed: 10k  [0603]  (hidden comment: RES 10K 0603)
R34  ValueDisplayed: 10k  [0603]  (hidden comment: RES 10K 0603)
R35  ValueDisplayed: 1k  [0603]  (hidden comment: RES 10K 0603)
R36  ValueDisplayed: 1k  [0603]  (hidden comment: RES 10K 0603)
R37  ValueDisplayed: 1k  [0603]  (hidden comment: RES 10K 0603)
R38  ValueDisplayed: 1k  [0603]  (hidden comment: RES 10K 0603)
R39  ValueDisplayed: 10k  [0603]  (hidden comment: RES 10K 0603)
R40  ValueDisplayed: 10k  [0603]  (hidden comment: RES 10K 0603)
R41  ValueDisplayed: 1k  [0603]  (hidden comment: RES 10K 0603)
R42  ValueDisplayed: 1k  [0603]  (hidden comment: RES 10K 0603)
R43  ValueDisplayed: 1k  [0603]  (hidden comment: RES 10K 0603)
R44  ValueDisplayed: 1k  [0603]  (hidden comment: RES 10K 0603)
R45  ValueDisplayed: 10k  [0603]  (hidden comment: RES 10K 0603)
R46  ValueDisplayed: 10k  [0603]  (hidden comment: RES 10K 0603)

### Ports
COM0 (see 06_DIGITAL[2A]), COM0 (see 06_DIGITAL[4A]), COM1 (see 06_DIGITAL[2B]), COM1 (see 06_DIGITAL[4A]), COM2 (see 06_DIGITAL[2B]), COM2 (see 06_DIGITAL[4A]), COM3 (see 06_DIGITAL[2C]), COM3 (see 06_DIGITAL[4A]), COM4 (see 06_DIGITAL[3A]), COM4 (see 06_DIGITAL[4A]), COM5 (see 06_DIGITAL[3B]), COM5 (see 06_DIGITAL[4A]), COM6 (see 06_DIGITAL[3B]), COM6 (see 06_DIGITAL[4A]), COM7 (see 06_DIGITAL[3C]), COM7 (see 06_DIGITAL[4B]), DO0 (see 04_STM32F303VCT6[5B]), DO1 (see 04_STM32F303VCT6[5B]), DO2 (see 04_STM32F303VCT6[5B]), DO3 (see 04_STM32F303VCT6[5B]), DO4 (see 04_STM32F303VCT6[3B]), DO5 (see 04_STM32F303VCT6[3B]), DO6 (see 04_STM32F303VCT6[3B]), DO7 (see 04_STM32F303VCT6[3B]), NC0 (see 06_DIGITAL[2A]), NC0 (see 06_DIGITAL[4A]), NC1 (see 06_DIGITAL[2B]), NC1 (see 06_DIGITAL[4A]), NC2 (see 06_DIGITAL[2B]), NC2 (see 06_DIGITAL[4A]), NC3 (see 06_DIGITAL[2C]), NC3 (see 06_DIGITAL[4A]), NC4 (see 06_DIGITAL[3A]), NC4 (see 06_DIGITAL[4A]), NC5 (see 06_DIGITAL[3B]), NC5 (see 06_DIGITAL[4A]), NC6 (see 06_DIGITAL[3B]), NC6 (see 06_DIGITAL[4A]), NC7 (see 06_DIGITAL[3C]), NC7 (see 06_DIGITAL[4B]), NO0 (see 06_DIGITAL[2A]), NO0 (see 06_DIGITAL[4A]), NO1 (see 06_DIGITAL[2B]), NO1 (see 06_DIGITAL[4A]), NO2 (see 06_DIGITAL[2B]), NO2 (see 06_DIGITAL[4A]), NO3 (see 06_DIGITAL[2C]), NO3 (see 06_DIGITAL[4A]), NO4 (see 06_DIGITAL[3A]), NO4 (see 06_DIGITAL[4A]), NO5 (see 06_DIGITAL[3B]), NO5 (see 06_DIGITAL[4A]), NO6 (see 06_DIGITAL[3B]), NO6 (see 06_DIGITAL[4A]), NO7 (see 06_DIGITAL[3C]), NO7 (see 06_DIGITAL[4A])

### Nets
+5V: D3.C(K) D4.C(K) D5.C(K) D6.C(K) D7.C(K) D8.C(K) D9.C(K) D10.C(K) K1.A1 K2.A1 K3.A1 K4.A1 K5.A1 K6.A1 K7.A1 K8.A1 OK11.4(COL) OK12.4(COL) OK13.4(COL) OK14.4(COL) OK15.4(COL) OK16.4(COL) OK17.4(COL) OK18.4(COL)
GND: OK11.2(C) OK12.2(C) OK13.2(C) OK14.2(C) OK15.2(C) OK16.2(C) OK17.2(C) OK18.2(C) Q1.2(S) Q2.2(S) Q3.2(S) Q4.2(S) Q5.2(S) Q6.2(S) Q7.2(S) Q8.2(S) R27.2 R28.2 R33.2 R34.2 R39.2 R40.2 R45.2 R46.2
COM0: J7.3(Pin_3) K1.NC ; port COM0
COM1: J7.6(Pin_6) K3.NC ; port COM1
COM2: J7.9(Pin_9) K5.NC ; port COM2
COM3: J7.12(Pin_12) K7.NC ; port COM3
COM4: J7.15(Pin_15) K2.NC ; port COM4
COM5: J7.18(Pin_18) K4.NC ; port COM5
COM6: J7.21(Pin_21) K6.NC ; port COM6
COM7: J7.24(Pin_24) K8.NC ; port COM7
DO0: R23.2 ; port DO0
DO1: R29.2 ; port DO1
DO2: R35.2 ; port DO2
DO3: R41.2 ; port DO3
DO4: R24.2 ; port DO4
DO5: R30.2 ; port DO5
DO6: R36.2 ; port DO6
DO7: R42.2 ; port DO7
NC0: J7.2(Pin_2) K1.COM ; port NC0
NC1: J7.5(Pin_5) K3.COM ; port NC1
NC2: J7.8(Pin_8) K5.COM ; port NC2
NC3: J7.11(Pin_11) K7.COM ; port NC3
NC4: J7.14(Pin_14) K2.COM ; port NC4
NC5: J7.17(Pin_17) K4.COM ; port NC5
NC6: J7.20(Pin_20) K6.COM ; port NC6
NC7: J7.23(Pin_23) K8.COM ; port NC7
NO0: J7.1(Pin_1) K1.NO ; port NO0
NO1: J7.4(Pin_4) K3.NO ; port NO1
NO2: J7.7(Pin_7) K5.NO ; port NO2
NO3: J7.10(Pin_10) K7.NO ; port NO3
NO4: J7.13(Pin_13) K2.NO ; port NO4
NO5: J7.16(Pin_16) K4.NO ; port NO5
NO6: J7.19(Pin_19) K6.NO ; port NO6
NO7: J7.22(Pin_22) K8.NO ; port NO7
NetD3_A: D3.A K1.A2 Q1.3(D)
NetD4_A: D4.A K2.A2 Q2.3(D)
NetD5_A: D5.A K3.A2 Q3.3(D)
NetD6_A: D6.A K4.A2 Q4.3(D)
NetD7_A: D7.A K5.A2 Q5.3(D)
NetD8_A: D8.A K6.A2 Q6.3(D)
NetD9_A: D9.A K7.A2 Q7.3(D)
NetD10_A: D10.A K8.A2 Q8.3(D)
NetOK11_1: OK11.1(A) R23.1
NetOK11_3: OK11.3(EMIT) R25.2
NetOK12_1: OK12.1(A) R24.1
NetOK12_3: OK12.3(EMIT) R26.2
NetOK13_1: OK13.1(A) R29.1
NetOK13_3: OK13.3(EMIT) R31.2
NetOK14_1: OK14.1(A) R30.1
NetOK14_3: OK14.3(EMIT) R32.2
NetOK15_1: OK15.1(A) R35.1
NetOK15_3: OK15.3(EMIT) R37.2
NetOK16_1: OK16.1(A) R36.1
NetOK16_3: OK16.3(EMIT) R38.2
NetOK17_1: OK17.1(A) R41.1
NetOK17_3: OK17.3(EMIT) R43.2
NetOK18_1: OK18.1(A) R42.1
NetOK18_3: OK18.3(EMIT) R44.2
NetQ1_1: Q1.1(G) R25.1 R27.1
NetQ2_1: Q2.1(G) R26.1 R28.1
NetQ3_1: Q3.1(G) R31.1 R33.1
NetQ4_1: Q4.1(G) R32.1 R34.1
NetQ5_1: Q5.1(G) R37.1 R39.1
NetQ6_1: Q6.1(G) R38.1 R40.1
NetQ7_1: Q7.1(G) R43.1 R45.1
NetQ8_1: Q8.1(G) R44.1 R46.1

### Notes on the sheet
- Sub-system:
- Project:
- Design by:
- Sheet title:
- Sheet
- of
- Checked by:
- Approved by:
- Doc No:
- Revision:
- Size:
- Date:
- A3

### Library data of the parts
D3-D10 = 1N4148W: Diode Standard 100 V 300mA (DC) Surface Mount SOD-123; MF: Diodes Inc.; MP: 1N4148W-7; SnapEDA_Link: https://www.snapeda.com/parts/1N4148W-7/Diodes+Inc./view-part/?ref=snap; Package: SOD-123 Fairchild Semiconductor; Value: *; Check_prices: https://www.snapeda.com/parts/1N4148W-7/Diodes+Inc./view-part/?ref=eda
K1-K8 = SRD-05VDC-SL-C: 5V Trigger Relay Module For Arduino And Raspberry Pi 5V Trigger Relay Module For Arduino And Raspberry Pi; MF: Songle Relay; Check_prices: https://www.snapeda.com/parts/SRD-05VDC-SL-C/Songle+Relay/view-part/?ref=eda; Value: *; Availability: Not in stock; Price: None; Package: NON STANDARD-5 Songle Relay; MP: SRD-05VDC-SL-C; SnapEDA_Link: https://www.snapeda.com/parts/SRD-05VDC-SL-C/Songle+Relay/view-part/?ref=snap
OK11-OK18 = PC817C: as OK1 on sheet 05_INPUT; SnapEDA_Link: https://www.snapeda.com/parts/PC817/Renesas/view-part/?ref=snap; Package: None; Value: *; Check_prices: https://www.snapeda.com/parts/PC817/Renesas/view-part/?ref=eda
Q1-Q8 = 2N7002: Mosfet Array 2 N-Channel (Dual) 60V 300mA 500mW Surface Mount PG-SOT363-6; MF: onsemi; SnapEDA_Link: https://www.snapeda.com/parts/2N7002/Onsemi/view-part/?ref=snap; Package: SOT-23-3 ON Semiconductor; Value: *; MP: 2N7002; Check_prices: https://www.snapeda.com/parts/2N7002/Onsemi/view-part/?ref=eda
R23-R46 = RES 10K 0603 1%: RES, 10K, 1%, 0.1 W, AEC-Q200 Grade 0, 0603; Manufacturer: Vishay-Dale; PartNumber: CRCW060320R0JNEA; Power_W: 100mW; TempCo: 200 ppm/C; Value_Code: 20R0; Value1: 5%; Value: 20; EIA_Code: E24; SizeX_mm: 1.6; SizeY_mm: 0.8; SizeZ_mm: 1; Value2: 0.1W; SizeArea_mm2: 1.28; CompType: Resistor; AEC Qualified: Y; VDC_V: 75V; AEC Category: Q200; AEC Grade: 0; Supplier Part Number 2: 59M6784; Supplier 2: Newark; Supplier Part Number 3: 71-CRCW0603J-20-E3; Supplier 3: Mouser; RoHS: E; MountType: SMT; Supplier 1: Digi-Key; PackageReference: 0603; Tolerance_%: 5%; Res_ohm: 20; ComponentLink1Description: Datasheet link; Supplier Part Number 1: 541-20GCT-ND; Technology: Thick Film; ComponentLink1URL: http://www.vishay.com/docs/20035/dcrcwe3.pdf

## Sheet 07_DADC.SchDoc
size 420 x 297 mm; SheetNumber: 7; SheetTotal: 12
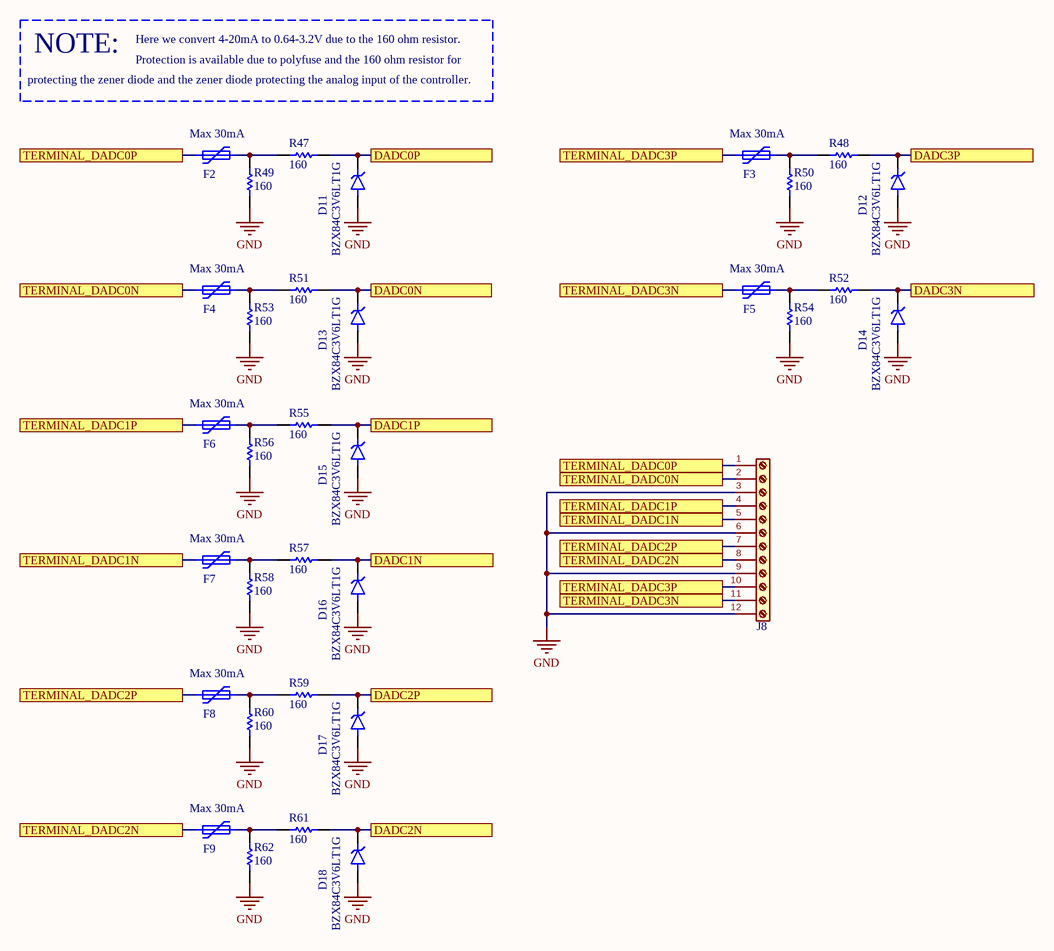
[diagram p4: 07_DADC.SchDoc]

### Parts
D11  BZX84C3V6LT1G  [SOT95P240X111-3N]
D12  BZX84C3V6LT1G  [SOT95P240X111-3N]
D13  BZX84C3V6LT1G  [SOT95P240X111-3N]
D14  BZX84C3V6LT1G  [SOT95P240X111-3N]
D15  BZX84C3V6LT1G  [SOT95P240X111-3N]
D16  BZX84C3V6LT1G  [SOT95P240X111-3N]
D17  BZX84C3V6LT1G  [SOT95P240X111-3N]
D18  BZX84C3V6LT1G  [SOT95P240X111-3N]
F2  Max 30mA  [Fuse_0603_1608Metric]
F3  Max 30mA  [Fuse_0603_1608Metric]
F4  Max 30mA  [Fuse_0603_1608Metric]
F5  Max 30mA  [Fuse_0603_1608Metric]
F6  Max 30mA  [Fuse_0603_1608Metric]
F7  Max 30mA  [Fuse_0603_1608Metric]
F8  Max 30mA  [Fuse_0603_1608Metric]
F9  Max 30mA  [Fuse_0603_1608Metric]
J8  Terminal_01x12_P5.00  [TerminalBlock_Phoenix_PT-1,5-12-5.0-H_1x12_P5.00mm_Horizontal]  (value not drawn)
R47  ValueDisplayed: 160  [0603]  (hidden comment: CRCW060320R0JNEA)
R48  ValueDisplayed: 160  [0603]  (hidden comment: CRCW060320R0JNEA)
R49  ValueDisplayed: 160  [0603]  (hidden comment: CRCW060320R0JNEA)
R50  ValueDisplayed: 160  [0603]  (hidden comment: CRCW060320R0JNEA)
R51  ValueDisplayed: 160  [0603]  (hidden comment: CRCW060320R0JNEA)
R52  ValueDisplayed: 160  [0603]  (hidden comment: CRCW060320R0JNEA)
R53  ValueDisplayed: 160  [0603]  (hidden comment: CRCW060320R0JNEA)
R54  ValueDisplayed: 160  [0603]  (hidden comment: CRCW060320R0JNEA)
R55  ValueDisplayed: 160  [0603]  (hidden comment: CRCW060320R0JNEA)
R56  ValueDisplayed: 160  [0603]  (hidden comment: CRCW060320R0JNEA)
R57  ValueDisplayed: 160  [0603]  (hidden comment: CRCW060320R0JNEA)
R58  ValueDisplayed: 160  [0603]  (hidden comment: CRCW060320R0JNEA)
R59  ValueDisplayed: 160  [0603]  (hidden comment: CRCW060320R0JNEA)
R60  ValueDisplayed: 160  [0603]  (hidden comment: CRCW060320R0JNEA)
R61  ValueDisplayed: 160  [0603]  (hidden comment: CRCW060320R0JNEA)
R62  ValueDisplayed: 160  [0603]  (hidden comment: CRCW060320R0JNEA)

### Ports
DADC0N (see 04_STM32F303VCT6[2B]), DADC0P (see 04_STM32F303VCT6[2B]), DADC1N (see 04_STM32F303VCT6[2B]), DADC1P (see 04_STM32F303VCT6[2B]), DADC2N (see 04_STM32F303VCT6[5C]), DADC2P (see 04_STM32F303VCT6[5C]), DADC3N (see 04_STM32F303VCT6[5C]), DADC3P (see 04_STM32F303VCT6[5C]), TERMINAL_DADC0N (see 07_DADC[1A]), TERMINAL_DADC0N (see 07_DADC[2B]), TERMINAL_DADC0P (see 07_DADC[1A]), TERMINAL_DADC0P (see 07_DADC[2B]), TERMINAL_DADC1N (see 07_DADC[1B]), TERMINAL_DADC1N (see 07_DADC[2B]), TERMINAL_DADC1P (see 07_DADC[1B]), TERMINAL_DADC1P (see 07_DADC[2B]), TERMINAL_DADC2N (see 07_DADC[1C]), TERMINAL_DADC2N (see 07_DADC[2B]), TERMINAL_DADC2P (see 07_DADC[1B]), TERMINAL_DADC2P (see 07_DADC[2B]), TERMINAL_DADC3N (see 07_DADC[2A]), TERMINAL_DADC3N (see 07_DADC[2B]), TERMINAL_DADC3P (see 07_DADC[2A]), TERMINAL_DADC3P (see 07_DADC[2B])

### Nets
GND: D11.1(A) D12.1(A) D13.1(A) D14.1(A) D15.1(A) D16.1(A) D17.1(A) D18.1(A) J8.3(Pin_3) J8.6(Pin_6) J8.9(Pin_9) J8.12(Pin_12) R49.1 R50.1 R53.1 R54.1 R56.1 R58.1 R60.1 R62.1
DADC0N: D13.3(K) R51.2 ; port DADC0N
DADC0P: D11.3(K) R47.2 ; port DADC0P
DADC1N: D16.3(K) R57.2 ; port DADC1N
DADC1P: D15.3(K) R55.2 ; port DADC1P
DADC2N: D18.3(K) R61.2 ; port DADC2N
DADC2P: D17.3(K) R59.2 ; port DADC2P
DADC3N: D14.3(K) R52.2 ; port DADC3N
DADC3P: D12.3(K) R48.2 ; port DADC3P
TERMINAL_DADC0N: F4.1 J8.2(Pin_2) ; port TERMINAL_DADC0N
TERMINAL_DADC0P: F2.1 J8.1(Pin_1) ; port TERMINAL_DADC0P
TERMINAL_DADC1N: F7.1 J8.5(Pin_5) ; port TERMINAL_DADC1N
TERMINAL_DADC1P: F6.1 J8.4(Pin_4) ; port TERMINAL_DADC1P
TERMINAL_DADC2N: F9.1 J8.8(Pin_8) ; port TERMINAL_DADC2N
TERMINAL_DADC2P: F8.1 J8.7(Pin_7) ; port TERMINAL_DADC2P
TERMINAL_DADC3N: F5.1 J8.11(Pin_11) ; port TERMINAL_DADC3N
TERMINAL_DADC3P: F3.1 J8.10(Pin_10) ; port TERMINAL_DADC3P
NetF2_2: F2.2 R47.1 R49.2
NetF3_2: F3.2 R48.1 R50.2
NetF4_2: F4.2 R51.1 R53.2
NetF5_2: F5.2 R52.1 R54.2
NetF6_2: F6.2 R55.1 R56.2
NetF7_2: F7.2 R57.1 R58.2
NetF8_2: F8.2 R59.1 R60.2
NetF9_2: F9.2 R61.1 R62.2

### Notes on the sheet
- Here we convert 4-20mA to 0.64-3.2V due to the 160 ohm resistor.
- protecting the zener diode and the zener diode protecting the analog input of the controller.
- NOTE:
- Protection is available due to polyfuse and the 160 ohm resistor for
- Sub-system:
- Project:
- Design by:
- Sheet title:
- Sheet
- of
- Checked by:
- Approved by:
- Doc No:
- Revision:
- Size:
- Date:
- A3

### Library data of the parts
D11-D18 = BZX84C3V6LT1G: MP: BZX84C10LT1G; Package: None; Price: None; Value: *; Availability: Unavailable
F2-F9 = Polyfuse 0603
R47-R62 = RES 160R 0603: RES, 160, 5%, 0.1 W, AEC-Q200 Grade 0, 0603; Manufacturer: Vishay-Dale; Power_W: 100mW; TempCo: 200 ppm/C; Value_Code: 20R0; Value: 20; EIA_Code: E24; SizeX_mm: 1.6; SizeY_mm: 0.8; SizeZ_mm: 1; Value2: 0.1W; SizeArea_mm2: 1.28; CompType: Resistor; AEC Qualified: Y; VDC_V: 75V; AEC Category: Q200; AEC Grade: 0; Supplier Part Number 2: 59M6784; Supplier 2: Newark; Supplier Part Number 3: 71-CRCW0603J-20-E3; Supplier 3: Mouser; RoHS: E; Value1: 5%; MountType: SMT; Supplier 1: Digi-Key; PackageReference: 0603; Tolerance_%: 5%; Res_ohm: 20; PartNumber: CRCW060320R0JNEA; ComponentLink1Description: Datasheet link; Supplier Part Number 1: 541-20GCT-ND; Technology: Thick Film; ComponentLink1URL: http://www.vishay.com/docs/20035/dcrcwe3.pdf